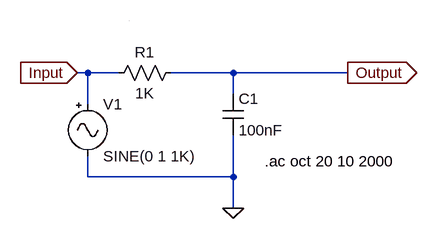
[diagram p0: schematic Draft1.asc]
Draft1.asc, the LTspice schematic file:
Version 4
SHEET 1 880 680
WIRE -64 80 -80 80
WIRE -16 80 -64 80
WIRE 160 80 64 80
WIRE 336 80 160 80
WIRE 160 112 160 80
WIRE -64 128 -64 80
WIRE -64 240 -64 208
WIRE 160 240 160 176
WIRE 160 240 -64 240
WIRE 160 288 160 240
WIRE 0 0 0 0
FLAG -80 80 Input
IOPIN -80 80 In
FLAG 336 80 Output
IOPIN 336 80 Out
FLAG 160 288 0
SYMBOL res 80 64 R90
WINDOW 0 0 56 VBottom 2
WINDOW 3 32 56 VTop 2
SYMATTR InstName R1
SYMATTR Value 1K
SYMBOL cap 144 112 R0
SYMATTR InstName C1
SYMATTR Value 100nF
SYMBOL Misc\\signal -64 112 R0
SYMATTR InstName V1
TEXT 208 216 Left 2 !.ac oct 20 10 2000

The netlist it stands for:
* Draft1.asc
R1 Output Input 1K
C1 Output 0 100nF
V1 Input 0 SINE(0 1 1K)
.ac oct 20 10 2000
.backanno
.end